# EAGLE schematic h_bridge_dev_board (EAGLE 7.2.0)
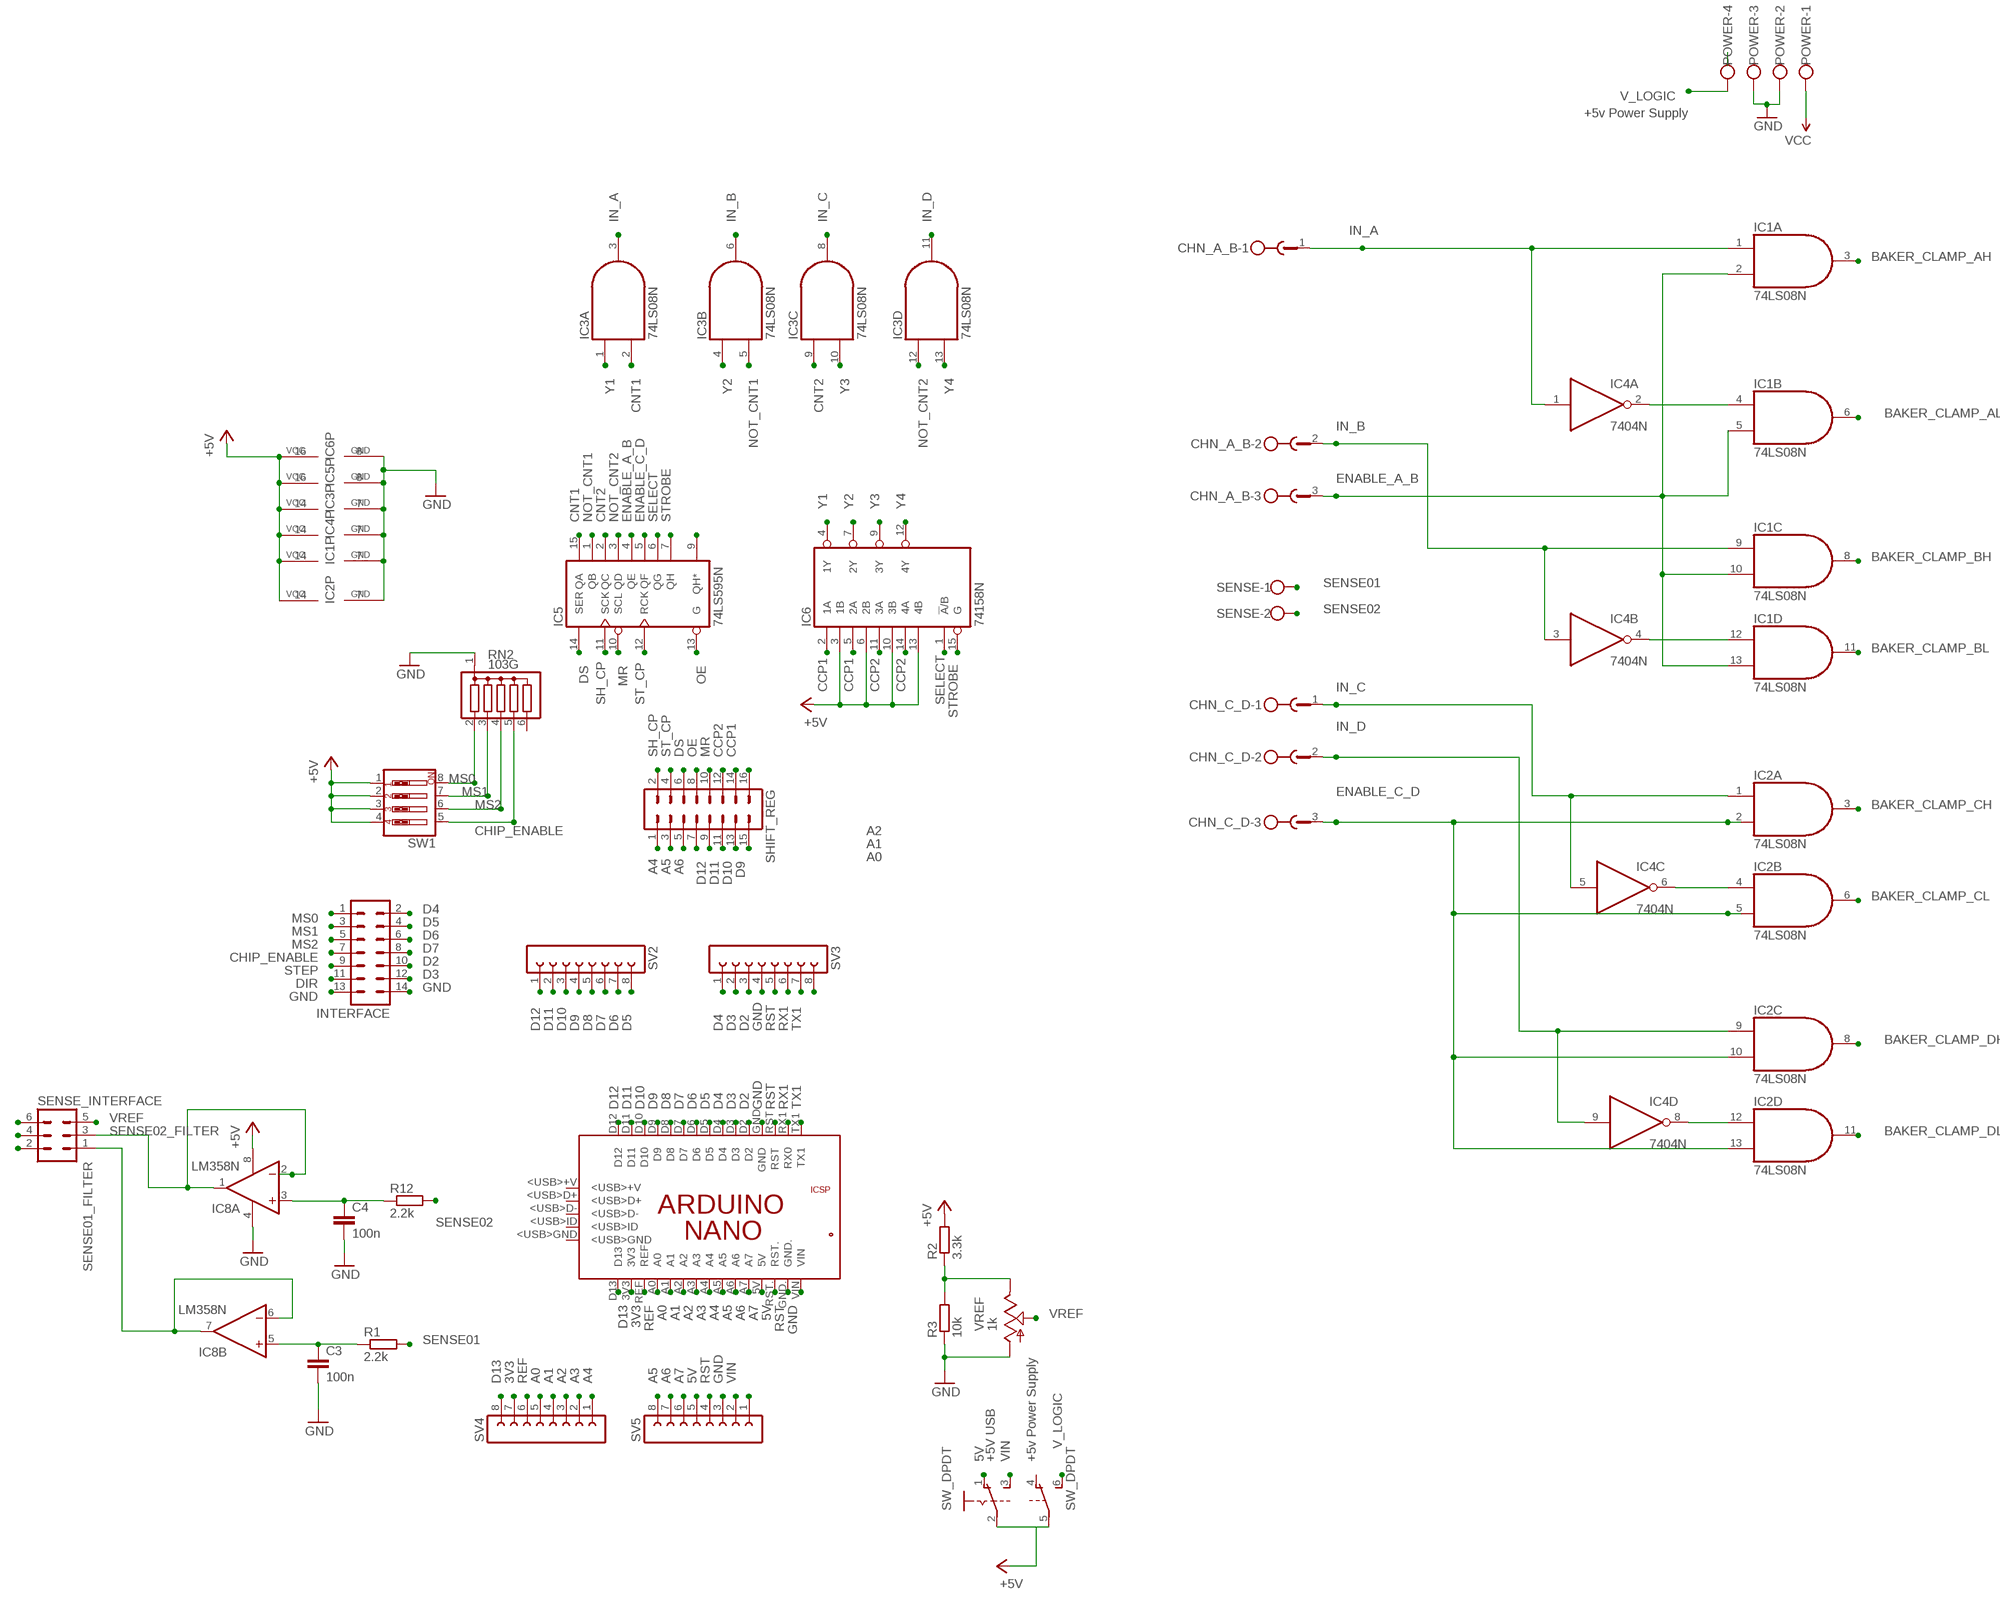
[diagram p0: schematic, sheet 1, part 1 of 2]
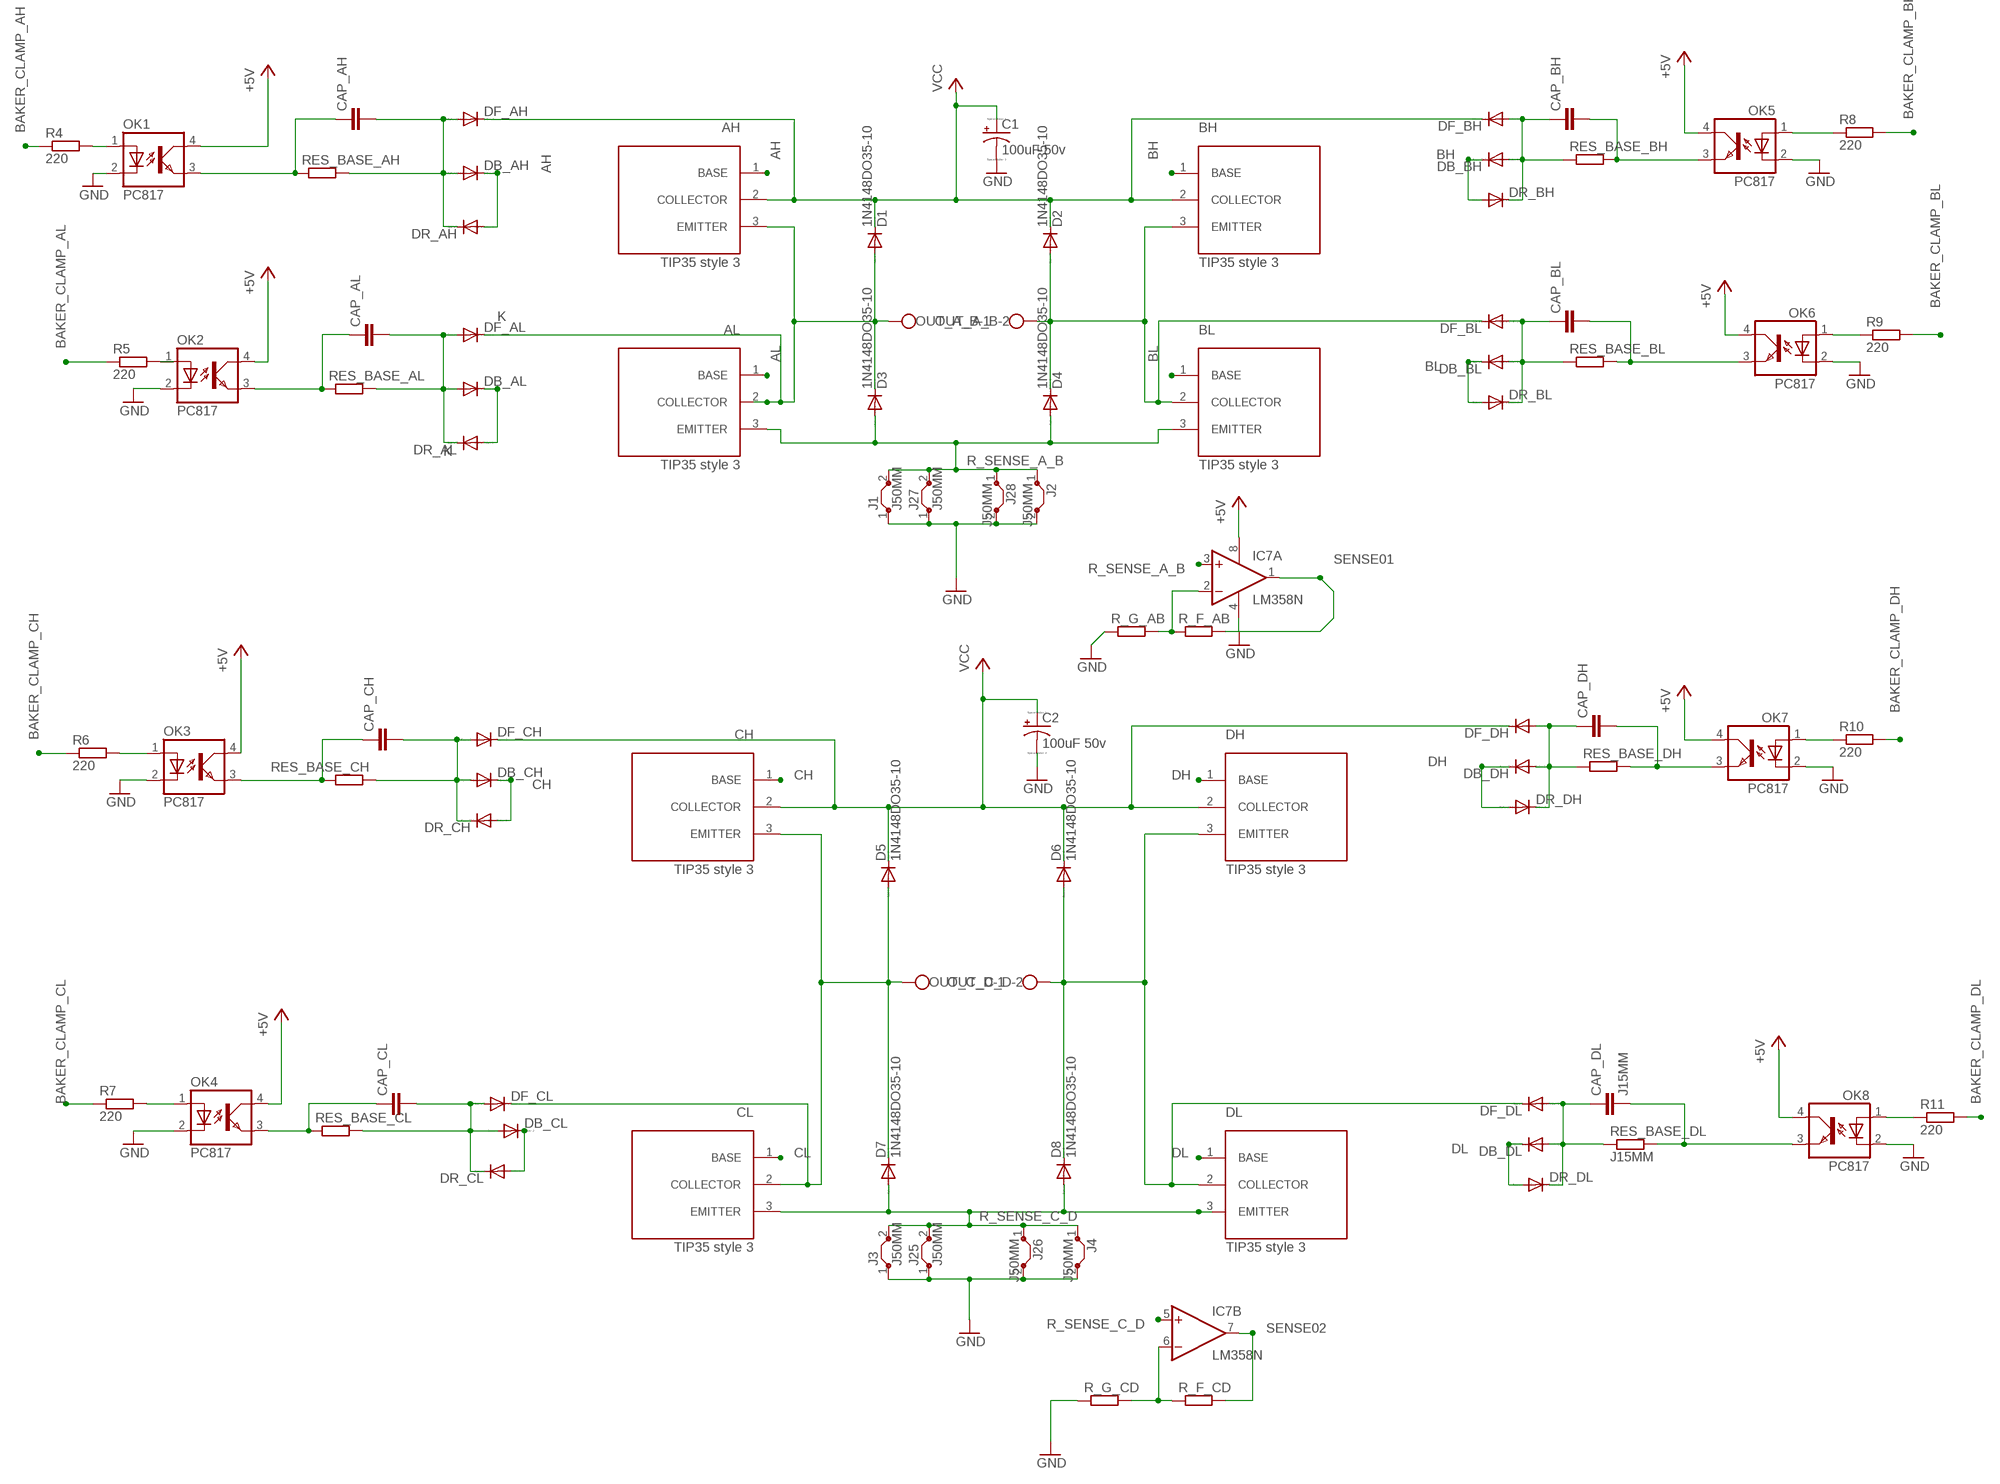
[diagram p1: schematic, sheet 1, part 2 of 2]

## Parts
AH  TIP35_STYLE3  [P-TO247]
AL  TIP35_STYLE3  [P-TO247]
BH  TIP35_STYLE3  [P-TO247]
BL  TIP35_STYLE3  [P-TO247]
C1  100uF 50v  CPOL-USE5-13  [E5-13]
C2  100uF 50v  CPOL-USE5-13  [E5-13]
C3  100n  C-EU050-030X075  [C050-030X075]
C4  100n  C-EU050-030X075  [C050-030X075]
CAP_AH  C-EU050-030X075  [C050-030X075]
CAP_AL  C-EU050-030X075  [C050-030X075]
CAP_BH  C-EU050-030X075  [C050-030X075]
CAP_BL  C-EU050-030X075  [C050-030X075]
CAP_CH  C-EU050-030X075  [C050-030X075]
CAP_CL  C-EU050-030X075  [C050-030X075]
CAP_DH  C-EU050-030X075  [C050-030X075]
CAP_DL  J15MM  C-EU050-030X075  [C050-030X075]
CH  TIP35_STYLE3  [P-TO247]
CHN_A_B  W232-3  [W232-3]
CHN_C_D  W232-3  [W232-3]
CL  TIP35_STYLE3  [P-TO247]
D1  1N4148DO35-10  [DO35-10]
D2  1N4148DO35-10  [DO35-10]
D3  1N4148DO35-10  [DO35-10]
D4  1N4148DO35-10  [DO35-10]
D5  1N4148DO35-10  [DO35-10]
D6  1N4148DO35-10  [DO35-10]
D7  1N4148DO35-10  [DO35-10]
D8  1N4148DO35-10  [DO35-10]
DB_AH  DIODE-DO27-15  [DO27-15]
DB_AL  DIODE-DO27-15  [DO27-15]
DB_BH  DIODE-DO27-15  [DO27-15]
DB_BL  DIODE-DO27-15  [DO27-15]
DB_CH  DIODE-DO27-15  [DO27-15]
DB_CL  DIODE-DO27-15  [DO27-15]
DB_DH  DIODE-DO27-15  [DO27-15]
DB_DL  DIODE-DO27-15  [DO27-15]
DF_AH  DIODE-DO27-15  [DO27-15]
DF_AL  DIODE-DO27-15  [DO27-15]
DF_BH  DIODE-DO27-15  [DO27-15]
DF_BL  DIODE-DO27-15  [DO27-15]
DF_CH  DIODE-DO27-15  [DO27-15]
DF_CL  DIODE-DO27-15  [DO27-15]
DF_DH  DIODE-DO27-15  [DO27-15]
DF_DL  DIODE-DO27-15  [DO27-15]
DH  TIP35_STYLE3  [P-TO247]
DL  TIP35_STYLE3  [P-TO247]
DR_AH  DIODE-DO27-15  [DO27-15]
DR_AL  DIODE-DO27-15  [DO27-15]
DR_BH  DIODE-DO27-15  [DO27-15]
DR_BL  DIODE-DO27-15  [DO27-15]
DR_CH  DIODE-DO27-15  [DO27-15]
DR_CL  DIODE-DO27-15  [DO27-15]
DR_DH  DIODE-DO27-15  [DO27-15]
DR_DL  DIODE-DO27-15  [DO27-15]
IC1  74LS08N  [DIL14]
IC2  74LS08N  [DIL14]
IC3  74LS08N  [DIL14]
IC4  7404N  [DIL14]
IC5  74LS595N  [DIL16]
IC6  74158N  [DIL16]
IC7  LM358N  [DIL08]
IC8  LM358N  [DIL08]
INTERFACE  MA07-2  [MA07-2]
J1  J50MM  [50]
J2  J50MM  [50]
J3  J50MM  [50]
J4  J50MM  [50]
J25  J50MM  [50]
J26  J50MM  [50]
J27  J50MM  [50]
J28  J50MM  [50]
OK1  PC817  [DIL04]
OK2  PC817  [DIL04]
OK3  PC817  [DIL04]
OK4  PC817  [DIL04]
OK5  PC817  [DIL04]
OK6  PC817  [DIL04]
OK7  PC817  [DIL04]
OK8  PC817  [DIL04]
OUT_A_B  W237-102  [W237-102]
OUT_C_D  W237-102  [W237-102]
PCB1  ARDUINO_NANO  [ARDUINO_NANO]
POWER  W237-4  [W237-4]
R1  2.2k  R-EU_0207/10  [0207/10]
R2  3.3k  R-EU_0207/10  [0207/10]
R3  10k  R-EU_0207/10  [0207/10]
R4  220  R-EU_0207/10  [0207/10]
R5  220  R-EU_0207/10  [0207/10]
R6  220  R-EU_0207/10  [0207/10]
R7  220  R-EU_0207/10  [0207/10]
R8  220  R-EU_0207/10  [0207/10]
R9  220  R-EU_0207/10  [0207/10]
R10  220  R-EU_0207/10  [0207/10]
R11  220  R-EU_0207/10  [0207/10]
R12  2.2k  R-EU_0207/10  [0207/10]
R_F_AB  R-EU_0207/10  [0207/10]
R_F_CD  R-EU_0207/10  [0207/10]
R_G_AB  R-EU_0207/10  [0207/10]
R_G_CD  R-EU_0207/10  [0207/10]
RES_BASE_AH  R-EU_0207/10  [0207/10]
RES_BASE_AL  R-EU_0207/10  [0207/10]
RES_BASE_BH  R-EU_0207/10  [0207/10]
RES_BASE_BL  R-EU_0207/10  [0207/10]
RES_BASE_CH  R-EU_0207/10  [0207/10]
RES_BASE_CL  R-EU_0207/10  [0207/10]
RES_BASE_DH  R-EU_0207/10  [0207/10]
RES_BASE_DL  J15MM  R-EU_0207/10  [0207/10]
RN2  103G  G05R  [SIL6]
SENSE  W237-102  [W237-102]
SENSE_INTERFACE  MA03-2  [MA03-2]
SHIFT_REG  MA08-2  [MA08-2]
SV2  FE08-1  [FE08]
SV3  FE08-1  [FE08]
SV4  FE08-1  [FE08]
SV5  FE08-1  [FE08]
SW1  SW_DIP-4  [EDG-04]
SW_DPDT  A68-A31  [A68-A31]
VREF  1k  TRIM_US-B25U  [B25U]

## Nets
3V3: PCB1.3V3 SV4.7
5V: PCB1.5V SV5.5 SW_DPDT.1(A:O)
+5V: IC1.14(P:VCC) IC2.14(P:VCC) IC3.14(P:VCC) IC4.14(P:VCC) IC5.16(VCC) IC6.3(1B) IC6.6(2B) IC6.10(3B) IC6.13(4B) IC6.16(VCC) IC7.8(P:V+) IC8.8(P:V+) OK1.4(COL) OK2.4(COL) OK3.4(COL) OK4.4(COL) OK5.4(COL) OK6.4(COL) OK7.4(COL) OK8.4(COL) R2.2 SW1.1 SW1.2 SW1.3 SW1.4 SW_DPDT.2(A:P) SW_DPDT.5(B:P)
A0: PCB1.A0 SENSE_INTERFACE.2 SV4.5
A1: PCB1.A1 SENSE_INTERFACE.4 SV4.4
A2: PCB1.A2 SENSE_INTERFACE.6 SV4.3
A3: PCB1.A3 SV4.2
A4: PCB1.A4 SHIFT_REG.1 SV4.1
A5: PCB1.A5 SHIFT_REG.3 SV5.8
A6: PCB1.A6 SHIFT_REG.5 SV5.7
A7: PCB1.A7 SV5.6
AH: AH.1(BASE) DB_AH.C DR_AH.A
AL: AL.1(BASE) DB_AL.C DR_AL.A
BAKER_CLAMP_AH: IC1.3(A:O) R4.1
BAKER_CLAMP_AL: IC1.6(B:O) R5.1
BAKER_CLAMP_BH: IC1.8(C:O) R8.2
BAKER_CLAMP_BL: IC1.11(D:O) R9.2
BAKER_CLAMP_CH: IC2.3(A:O) R6.1
BAKER_CLAMP_CL: IC2.6(B:O) R7.1
BAKER_CLAMP_DH: IC2.8(C:O) R10.2
BAKER_CLAMP_DL: IC2.11(D:O) R11.2
BH: BH.1(BASE) DB_BH.C DR_BH.A
BL: BL.1(BASE) DB_BL.C DR_BL.A
CCP1: IC6.2(1A) IC6.5(2A) SHIFT_REG.14
CCP2: IC6.11(3A) IC6.14(4A) SHIFT_REG.12
CH: CH.1(BASE) DB_CH.C DR_CH.A
CHIP_ENABLE: INTERFACE.7 RN2.5 SW1.5
CL: CL.1(BASE) DB_CL.C DR_CL.A
CNT1: IC3.2(A:I1) IC5.15(QA)
CNT2: IC3.9(C:I0) IC5.2(QC)
D2: INTERFACE.10 PCB1.D2 SV3.3
D3: INTERFACE.12 PCB1.D3 SV3.2
D4: INTERFACE.2 PCB1.D4 SV3.1
D5: INTERFACE.4 PCB1.D5 SV2.8
D6: INTERFACE.6 PCB1.D6 SV2.7
D7: INTERFACE.8 PCB1.D7 SV2.6
D8: PCB1.D8 SV2.5
D9: PCB1.D9 SHIFT_REG.13 SV2.4
D10: PCB1.D10 SHIFT_REG.11 SV2.3
D11: PCB1.D11 SHIFT_REG.9 SV2.2
D12: PCB1.D12 SHIFT_REG.7 SV2.1
D13: PCB1.D13 SV4.8
DH: DB_DH.C DH.1(BASE) DR_DH.A
DIR: INTERFACE.11
DL: DB_DL.C DL.1(BASE) DR_DL.A
DS: IC5.14(SER) SHIFT_REG.6
ENABLE_A_B: CHN_A_B.3 IC1.2(A:I1) IC1.5(B:I1) IC1.10(C:I1) IC1.13(D:I1) IC5.4(QE)
ENABLE_C_D: CHN_C_D.3 IC2.2(A:I1) IC2.5(B:I1) IC2.10(C:I1) IC2.13(D:I1) IC5.5(QF)
GND: C1.- C2.- C3.2 C4.2 IC1.7(P:GND) IC2.7(P:GND) IC3.7(P:GND) IC4.7(P:GND) IC5.8(GND) IC6.8(GND) IC7.4(P:V-) IC8.4(P:V-) INTERFACE.13 INTERFACE.14 J1.1 J2.2 J3.1 J4.2 J25.1 J26.2 J27.1 J28.2 OK1.2(C) OK2.2(C) OK3.2(C) OK4.2(C) OK5.2(C) OK6.2(C) OK7.2(C) OK8.2(C) PCB1.GND PCB1.GND. POWER.2 POWER.3 R3.1 R_G_AB.1 R_G_CD.1 RN2.1 SV3.4 SV5.3 VREF.A
IN_A: CHN_A_B.1 IC1.1(A:I0) IC3.3(A:O) IC4.1(A:I)
IN_B: CHN_A_B.2 IC1.9(C:I0) IC3.6(B:O) IC4.3(B:I)
IN_C: CHN_C_D.1 IC2.1(A:I0) IC3.8(C:O) IC4.5(C:I)
IN_D: CHN_C_D.2 IC2.9(C:I0) IC3.11(D:O) IC4.9(D:I)
MR: IC5.10(SCL) SHIFT_REG.10
MS0: INTERFACE.1 RN2.2 SW1.8
MS1: INTERFACE.3 RN2.3 SW1.7
MS2: INTERFACE.5 RN2.4 SW1.6
N$1: IC1.12(D:I0) IC4.4(B:O)
N$2: R2.1 R3.2 VREF.E
N$4: CAP_AL.2 DB_AL.A DF_AL.A DR_AL.C RES_BASE_AL.2
N$5: CAP_CH.2 DB_CH.A DF_CH.A DR_CH.C RES_BASE_CH.1
N$6: CAP_BL.1 DB_BL.A DF_BL.A DR_BL.C RES_BASE_BL.1
N$8: CAP_DH.1 DB_DH.A DF_DH.A DR_DH.C RES_BASE_DH.1
N$11: IC2.4(B:I0) IC4.6(C:O)
N$12: OK1.1(A) R4.2
N$13: IC2.12(D:I0) IC4.8(D:O)
N$14: OK2.1(A) R5.2
N$15: OK3.1(A) R6.2
N$16: IC7.6(B:-IN) R_F_CD.1 R_G_CD.2
N$17: OK4.1(A) R7.2
N$18: IC7.2(A:-IN) R_F_AB.1 R_G_AB.2
N$19: CAP_CL.2 DB_CL.A DF_CL.A DR_CL.C RES_BASE_CL.2
N$20: CAP_AH.2 DB_AH.A DF_AH.A DR_AH.C RES_BASE_AH.2
N$21: CAP_BH.1 DB_BH.A DF_BH.A DR_BH.C RES_BASE_BH.1
N$25: IC1.4(B:I0) IC4.2(A:O)
N$27: OK8.1(A) R11.1
N$29: CAP_DL.1 DB_DL.A DF_DL.A DR_DL.C RES_BASE_DL.1
N$30: OK7.1(A) R10.1
N$31: SHIFT_REG.15
N$32: OK6.1(A) R9.1
N$33: OK5.1(A) R8.1
N$34: CAP_DL.2 OK8.3(EMIT) RES_BASE_DL.2
N$35: CAP_BH.2 OK5.3(EMIT) RES_BASE_BH.2
N$36: CAP_BL.2 OK6.3(EMIT) RES_BASE_BL.2
N$37: CAP_DH.2 OK7.3(EMIT) RES_BASE_DH.2
N$38: CAP_CL.1 OK4.3(EMIT) RES_BASE_CL.1
N$39: CAP_CH.1 OK3.3(EMIT) RES_BASE_CH.2
N$40: SV3.8
N$41: IC5.9(QH*)
N$42: CAP_AL.1 OK2.3(EMIT) RES_BASE_AL.1
N$43: CAP_AH.1 OK1.3(EMIT) RES_BASE_AH.1
N$46: C3.1 IC8.5(B:+IN) R1.1
N$47: C4.1 IC8.3(A:+IN) R12.1
N$56: SV5.1
NOT_CNT1: IC3.5(B:I1) IC5.1(QB)
NOT_CNT2: IC3.12(D:I0) IC5.3(QD)
OE: IC5.13(G) SHIFT_REG.8
OUT_A: AH.3(EMITTER) AL.2(COLLECTOR) D1.A D3.C DF_AL.C OUT_A_B.1
OUT_B: BH.3(EMITTER) BL.2(COLLECTOR) D2.A D4.C DF_BL.C OUT_A_B.2
OUT_C: CH.3(EMITTER) CL.2(COLLECTOR) D5.A D7.C DF_CL.C OUT_C_D.1
OUT_D: D6.A D8.C DF_DL.C DH.3(EMITTER) DL.2(COLLECTOR) OUT_C_D.2
R_SENSE_A_B: AL.3(EMITTER) BL.3(EMITTER) D3.A D4.A IC7.3(A:+IN) J1.2 J2.1 J27.2 J28.1
R_SENSE_C_D: CL.3(EMITTER) D7.A D8.A DL.3(EMITTER) IC7.5(B:+IN) J3.2 J4.1 J25.2 J26.1
REF: PCB1.REF SV4.6
RST: PCB1.RST PCB1.RST. SV3.5 SV5.4
RX1: PCB1.RX1(RX0) SV3.6
SELECT: IC5.6(QG) IC6.1(!A!/B)
SENSE01: IC7.1(A:OUT) R1.2 R_F_AB.2 SENSE.1
SENSE01_FILTER: IC8.6(B:-IN) IC8.7(B:OUT) SENSE_INTERFACE.1
SENSE02: IC7.7(B:OUT) R12.2 R_F_CD.2 SENSE.2
SENSE02_FILTER: IC8.1(A:OUT) IC8.2(A:-IN) SENSE_INTERFACE.3
SH_CP: IC5.11(SCK) SHIFT_REG.2
ST_CP: IC5.12(RCK) SHIFT_REG.4
STEP: INTERFACE.9
STROBE: IC5.7(QH) IC6.15(G)
TEMP: SHIFT_REG.16
TX1: PCB1.TX1 SV3.7
V_LOGIC: POWER.4 SW_DPDT.6(B:S)
VCC: AH.2(COLLECTOR) BH.2(COLLECTOR) C1.+ C2.+ CH.2(COLLECTOR) D1.C D2.C D5.C D6.C DF_AH.C DF_BH.C DF_CH.C DF_DH.C DH.2(COLLECTOR) POWER.1
VIN: PCB1.VIN SV5.2 SW_DPDT.3(A:S)
VREF: SENSE_INTERFACE.5 VREF.S
Y1: IC3.1(A:I0) IC6.4(1Y)
Y2: IC3.4(B:I0) IC6.7(2Y)
Y3: IC3.10(C:I1) IC6.9(3Y)
Y4: IC3.13(D:I1) IC6.12(4Y)
Unconnected: IC4.10(E:O) IC4.11(E:I) IC4.12(F:O) IC4.13(F:I) PCB1.5V. PCB1.<USB>+V PCB1.<USB>D+ PCB1.<USB>D- PCB1.<USB>GND PCB1.<USB>ID PCB1.GND_ PCB1.MISO PCB1.MOSI PCB1.RESET.. PCB1.SCK RN2.6 SW_DPDT.4(B:O)

## Notes on the sheet
- +5v Power Supply
- K
- K
- +5V USB
  
  
  +5v Power Supply

## Library data of the parts
AH AL BH BL CH CL DH DL = tip35_style3:TIP35_STYLE3
C1 C2 = resistor:CPOL-US: POLARIZED CAPACITOR, American symbol
C3 C4 CAP_AH CAP_AL CAP_BH CAP_BL CAP_CH CAP_CL CAP_DH CAP_DL = rcl:C-EU: CAPACITOR, European symbol
CHN_A_B CHN_C_D = con-wago-508:W232-3: WAGO SREW CLAMP; OC_FARNELL: unknown; OC_NEWARK: unknown
D1-D8 = diode:1N4148: DIODE high speed (Philips)
DB_AH DB_AL DB_BH DB_BL DB_CH DB_CL DB_DH DB_DL DF_AH DF_AL DF_BH DF_BL DF_CH DF_CL DF_DH DF_DL DR_AH DR_AL DR_BH DR_BL DR_CH DR_CL DR_DH DR_DL = diode:DIODE-: DIODE
IC1-IC3 = 74xx-us:74*08: Quad 2-input AND gate
IC4 = 74xx-us:74*04: Hex INVERTER
IC5 = 74xx-us:74*595: 8-bit SHIFT REGISTER, output latch
IC6 = 74xx-us:74*158: Quadruple 2-line to 1-line data SELECTOR/MULTIPLEXER
IC7 IC8 = linear:LM358: OP AMP also LM158; LM258; LM2904 Source: http://cache.national.com/ds/LM/LM158.pdf
INTERFACE = con-lstb:MA07-2: PIN HEADER; OC_FARNELL: unknown; OC_NEWARK: unknown
J1-J4 J25-J28 = jumper:J: Bridge
OK1-OK8 = optocoupler:PC817: SHARP OPTO COUPLER; MPN: PC817X4J000F; OC_FARNELL: 9707727; OC_NEWARK: 97K7059
OUT_A_B OUT_C_D SENSE = con-wago-500:W237-102: WAGO SCREW CLAMP; MPN: 237-102; OC_FARNELL: unknown; OC_NEWARK: 70K9898
PCB1 = E14_Arduino_revC:ARDUINO_NANO: Device for representing an Arduino Nano board with a footprint in an EAGLE design. Created by Dave Young for Element14. More EAGLE documentation at: http://www.element14.com/community/community/knode/cadsoft_eagle
POWER = con-wago-500:W237-4: WAGO SCREW CLAMP; OC_FARNELL: unknown; OC_NEWARK: unknown
R1-R12 R_F_AB R_F_CD R_G_AB R_G_CD RES_BASE_AH RES_BASE_AL RES_BASE_BH RES_BASE_BL RES_BASE_CH RES_BASE_CL RES_BASE_DH RES_BASE_DL = rcl:R-EU_: RESISTOR, European symbol
RN2 = resistor-sil:G05R: SIL RESISTOR; OC_FARNELL: unknown; OC_NEWARK: unknown
SENSE_INTERFACE = con-lstb:MA03-2: PIN HEADER; OC_FARNELL: unknown; OC_NEWARK: unknown
SHIFT_REG = con-lstb:MA08-2: PIN HEADER; OC_FARNELL: unknown; OC_NEWARK: unknown
SV2-SV5 = con-lsta:FE08-1: FEMALE HEADER; OC_FARNELL: unknown; OC_NEWARK: unknown
SW1 = special:SW_DIP-4: DIP SWITCH
SW_DPDT = switch:A68-A31: SLIDING SWITCH Siemens, distributor Buerklin, 11G766
VREF = pot:TRIM_US-: POTENTIOMETER